# Altium project MBP Universal Upgrade.PrjPcb
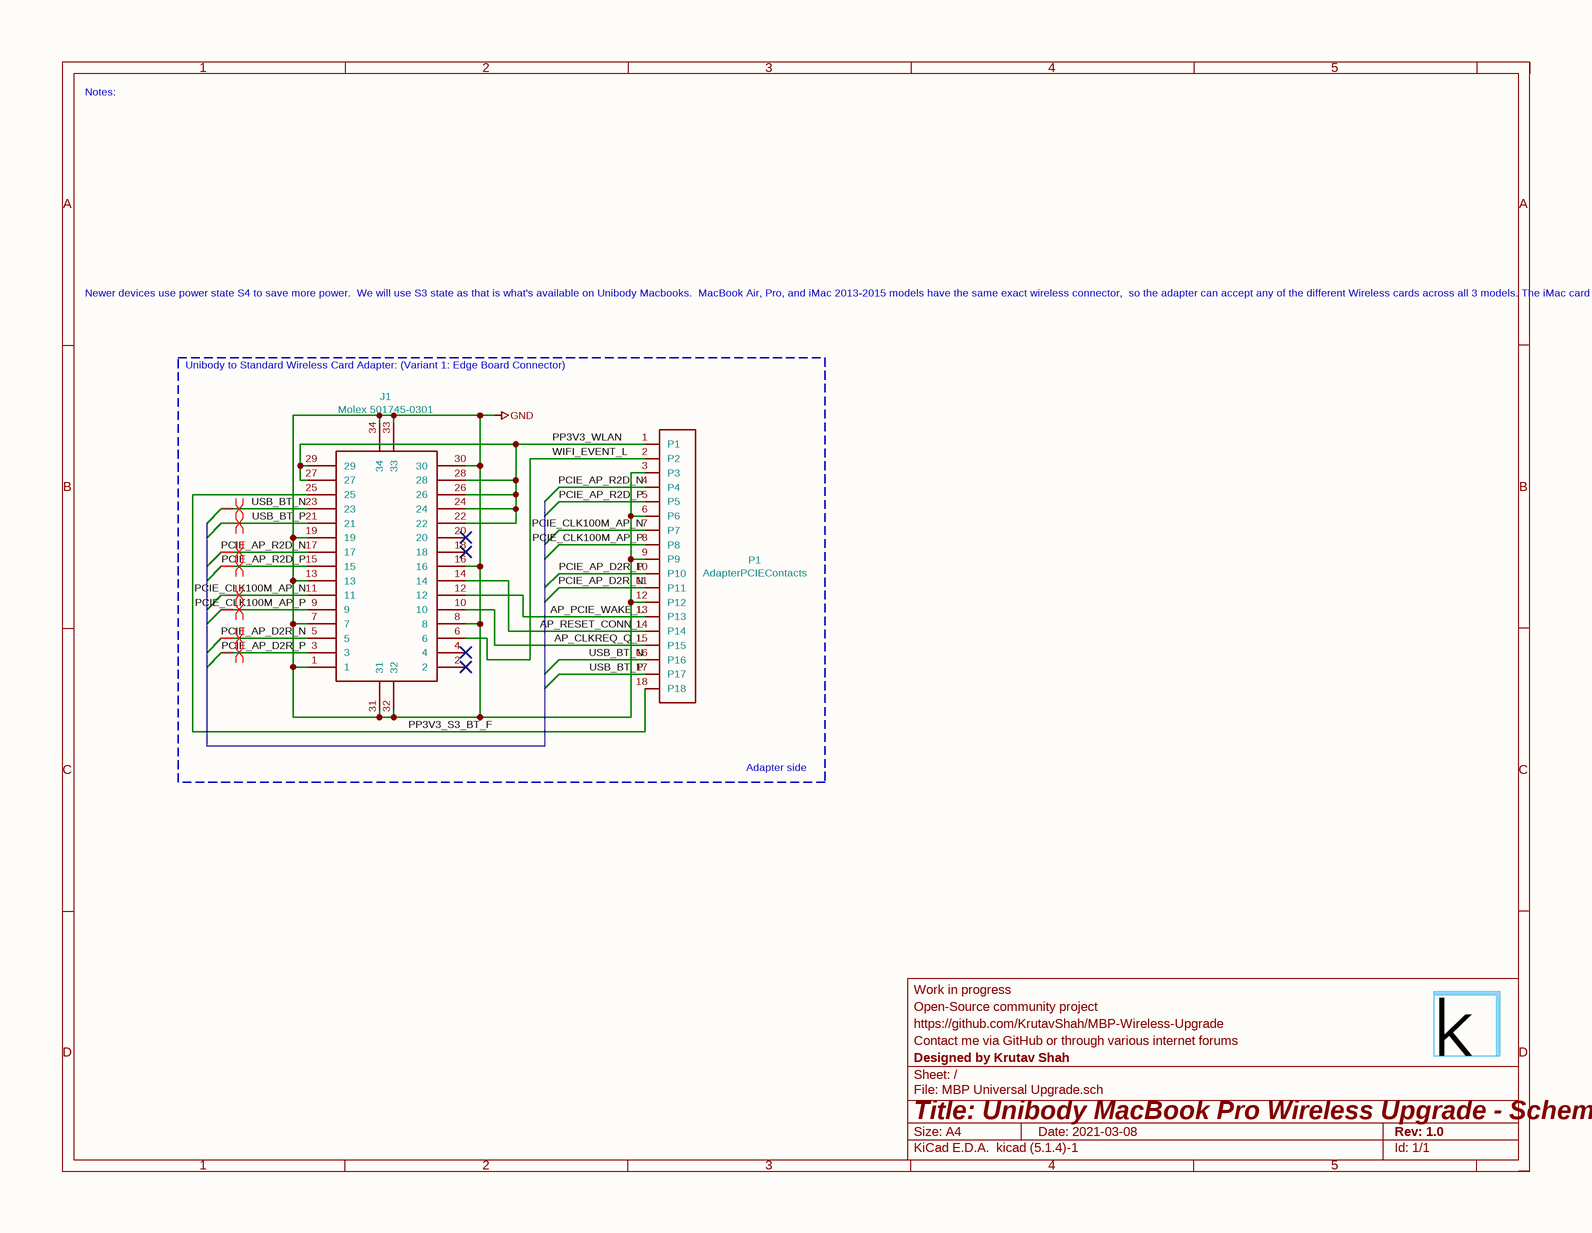
[diagram p0: MBP Universal Upgrade.SchDoc]
1 sheet, 2 parts. Net scope: global (net labels, ports and power ports of the same name join across sheets).
Board file: MBP Universal Upgrade.PcbDoc

## Sheet MBP Universal Upgrade.SchDoc
size 279 x 215 mm

### Parts
J1  Molex 501745-0301  [5017450301]
P1  AdapterPCIEContacts  [Edge Connector]

### Blocks framed on the sheet
Adapter side: J1 P1

### Nets
GND: J1.1 J1.7 J1.8 J1.13 J1.16 J1.19 J1.30 J1.31 J1.32 J1.33 J1.34 P1.3(P3) P1.6(P6) P1.9(P9) P1.12(P12)
AP_CLKREQ_Q_L: J1.10 P1.15(P15)
AP_PCIE_WAKE_L: J1.12 P1.13(P13)
AP_RESET_CONN_L: J1.14 P1.14(P14)
PCIE_AP_D2R_N: J1.5 P1.11(P11)
PCIE_AP_D2R_P: J1.3 P1.10(P10)
PCIE_AP_R2D_N: J1.17 P1.4(P4)
PCIE_AP_R2D_P: J1.15 P1.5(P5)
PCIE_CLK100M_AP_N: J1.11 P1.7(P7)
PCIE_CLK100M_AP_P: J1.9 P1.8(P8)
PP3V3_S3_BT_F: J1.25 P1.18(P18)
PP3V3_WLAN: J1.22 J1.24 J1.26 J1.27 J1.28 J1.29 P1.1(P1)
USB_BT_N: J1.23 P1.16(P16)
USB_BT_P: J1.21 P1.17(P17)
WIFI_EVENT_L: J1.6 P1.2(P2)

Not connected (* = marked no-connect by the designer): J1 2* 4* 18* 20*

### Layout directives
differential pair: PCIE_AP_D2R_N, PCIE_AP_D2R_P, PCIE_AP_R2D_N, PCIE_AP_R2D_P, PCIE_CLK100M_AP_N, PCIE_CLK100M_AP_P, USB_BT_N, USB_BT_P

### Notes on the sheet
- Notes:
- Newer devices use power state S4 to save more power.
  We will use S3 state as that is what's available on Unibody Macbooks.
  MacBook Air, Pro, and iMac 2013-2015 models have the same exact wireless connector,
  so the adapter can accept any of the different Wireless cards across all 3 models.
  The iMac card is the larger of the 3, with 4 antenna connectors.
  The MBPro is in the middle in terms of size, and has 3 antenna connectors.
  The MBAir is the smallest and has 2 antenna connectors.
  The MacBook wireless cards have smaller antenna connectors,
  so you will need to desolder them and solder the larger ones from the
  old wireless card in your Unibody MacBook. (UFL connector)
  The new wireless cards do not use SMBus like the old ones.
  Those pins will be left unconnected.
  The connector for the adapter is a Molex part and can be pulled
  from a Uniboy Wireless flex cable or purchased new.
- Unibody to Standard Wireless Card Adapter: (Variant 1: Edge Board Connector)
- 1
- 2
- 3
- 4
- 5
- A
- B
- C
- Contact me via GitHub or through various internet forums
- https://github.com/KrutavShah/MBP-Wireless-Upgrade
- Open-Source community project
- Work in progress
- D
- Title: Unibody MacBook Pro Wireless Upgrade - Schematic
- File: MBP Universal Upgrade.sch
- Sheet: /
- Designed by Krutav Shah
- KiCad E.D.A.  kicad (5.1.4)-1
- Size: A4
- Date: 2021-03-08
- Rev: 1.0
- Id: 1/1

### Library data of the parts
J1 = 501745-0301: Description: Board to Board & Mezzanine Connectors 0.4 BB PLUG ASSY H=2 EMBSTP PKG; Height: 1.64; Mouser Part Number: 538-501745-0301; Mouser Price/Stock: https://www.mouser.com/Search/Refine.aspx?Keyword=538-501745-0301; Manufacturer_Name: Molex; Manufacturer_Part_Number: 501745-0301; Value: Molex 501745-0301
P1 = AdapterPCIEContacts: Value: AdapterPCIEContacts; Footprint: MBPWirelessUpgrade:Edge Connector